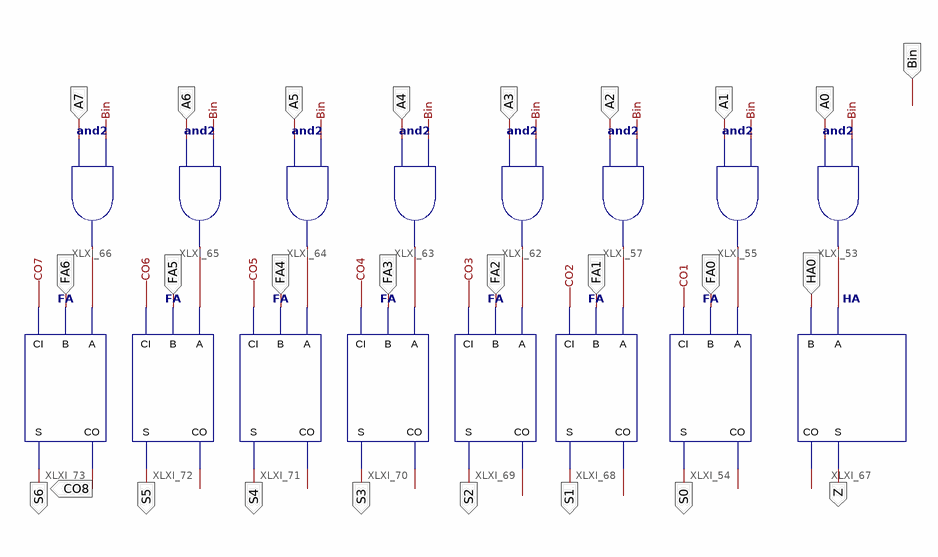
[diagram p0: schematic sheet 1]
// Xilinx ISE schematic MultBox.sch (spartan6) as structural Verilog: 16 symbols, 26 ports
module MultBox (
  input  A0,
  input  A1,
  input  A2,
  input  A3,
  input  A4,
  input  A5,
  input  A6,
  input  A7,
  input  HA0,
  input  FA0,
  input  FA1,
  input  FA2,
  input  FA3,
  input  FA4,
  input  FA5,
  input  FA6,
  input  Bin,
  output CO8,
  output S6,
  output S5,
  output S4,
  output S3,
  output S2,
  output S1,
  output S0,
  output Z
);

  wire CO1, CO2, CO3, CO4, CO5, CO6, CO7, XLXN_1, XLXN_3, XLXN_4, XLXN_5, XLXN_6, XLXN_7, XLXN_8, XLXN_9;

  FA XLXI_54 (.A(XLXN_3), .B(FA0), .CI(CO1), .CO(CO2), .S(S0));
  FA XLXI_68 (.A(XLXN_4), .B(FA1), .CI(CO2), .CO(CO3), .S(S1));
  FA XLXI_69 (.A(XLXN_5), .B(FA2), .CI(CO3), .CO(CO4), .S(S2));
  FA XLXI_70 (.A(XLXN_6), .B(FA3), .CI(CO4), .CO(CO5), .S(S3));
  FA XLXI_71 (.A(XLXN_7), .B(FA4), .CI(CO5), .CO(CO6), .S(S4));
  FA XLXI_72 (.A(XLXN_8), .B(FA5), .CI(CO6), .CO(CO7), .S(S5));
  FA XLXI_73 (.A(XLXN_9), .B(FA6), .CI(CO7), .CO(CO8), .S(S6));
  HA XLXI_67 (.A(XLXN_1), .B(HA0), .S(Z), .CO(CO1));
  and XLXI_53 (XLXN_1, A0, Bin);
  and XLXI_55 (XLXN_3, A1, Bin);
  and XLXI_57 (XLXN_4, A2, Bin);
  and XLXI_62 (XLXN_5, A3, Bin);
  and XLXI_63 (XLXN_6, A4, Bin);
  and XLXI_64 (XLXN_7, A5, Bin);
  and XLXI_65 (XLXN_8, A6, Bin);
  and XLXI_66 (XLXN_9, A7, Bin);
endmodule
